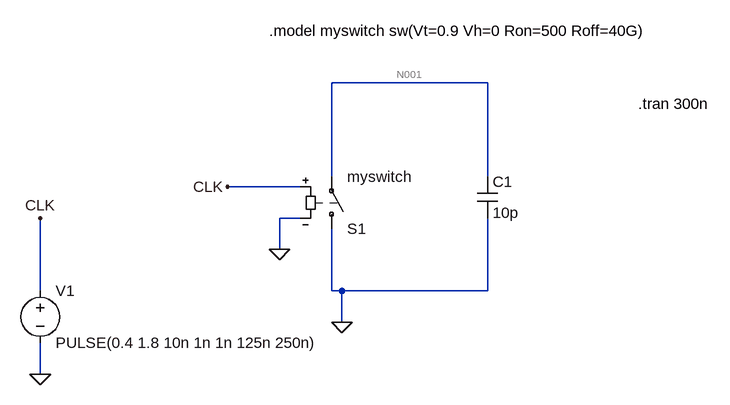
[diagram p0: schematic Draft2.asc]
Draft2.asc, the LTspice schematic file:
Version 4
SHEET 1 880 680
WIRE 352 -16 112 -16
WIRE 112 128 112 -16
WIRE 352 128 352 -16
WIRE 64 144 -48 144
WIRE 64 192 32 192
WIRE 32 240 32 192
WIRE -336 304 -336 192
WIRE 112 304 112 208
WIRE 128 304 112 304
WIRE 352 304 352 192
WIRE 352 304 128 304
WIRE 128 352 128 304
WIRE -336 432 -336 384
FLAG 128 352 0
FLAG 32 240 0
FLAG -48 144 CLK
FLAG -336 432 0
FLAG -336 192 CLK
SYMBOL sw 112 224 M180
SYMATTR InstName S1
SYMATTR Value myswitch
SYMBOL cap 336 128 R0
SYMATTR InstName C1
SYMATTR Value 10p
SYMBOL voltage -336 288 R0
WINDOW 123 0 0 Left 0
WINDOW 39 0 0 Left 0
SYMATTR InstName V1
SYMATTR Value PULSE(0.4 1.8 10n 1n 1n 125n 250n)
TEXT 16 -96 Left 2 !.model myswitch sw(Vt=0.9 Vh=0 Ron=500 Roff=40G)
TEXT 584 16 Left 2 !.tran 300n

The netlist it stands for:
* Draft2.asc
S1 0 N001 CLK 0 myswitch
C1 N001 0 10p
V1 CLK 0 PULSE(0.4 1.8 10n 1n 1n 125n 250n)
.model myswitch sw(Vt=0.9 Vh=0 Ron=500 Roff=40G)
.tran 300n
.backanno
.end

* Results of the author's LTspice run, read from the files saved beside the schematic
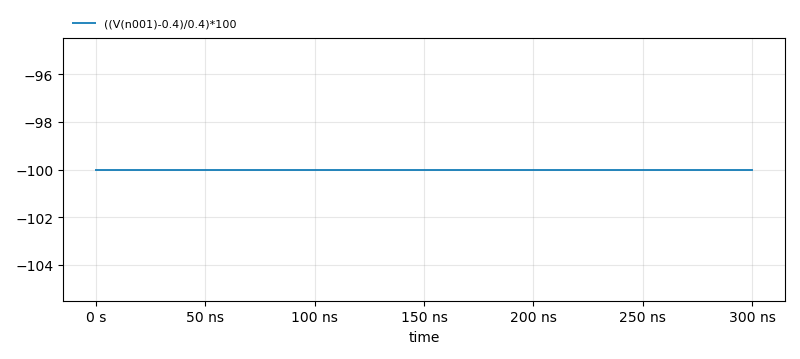
[diagram p1: Transient Analysis of Draft2.asc, plotted from the saved traces]
* Transient Analysis, 1 run:
*   ((V(n001)-0.4)/0.4)*100: min -100 , max -100 , average -100 , rms 100 , last -100 